# EAGLE design TestBench SD Shield (EAGLE 6.1)
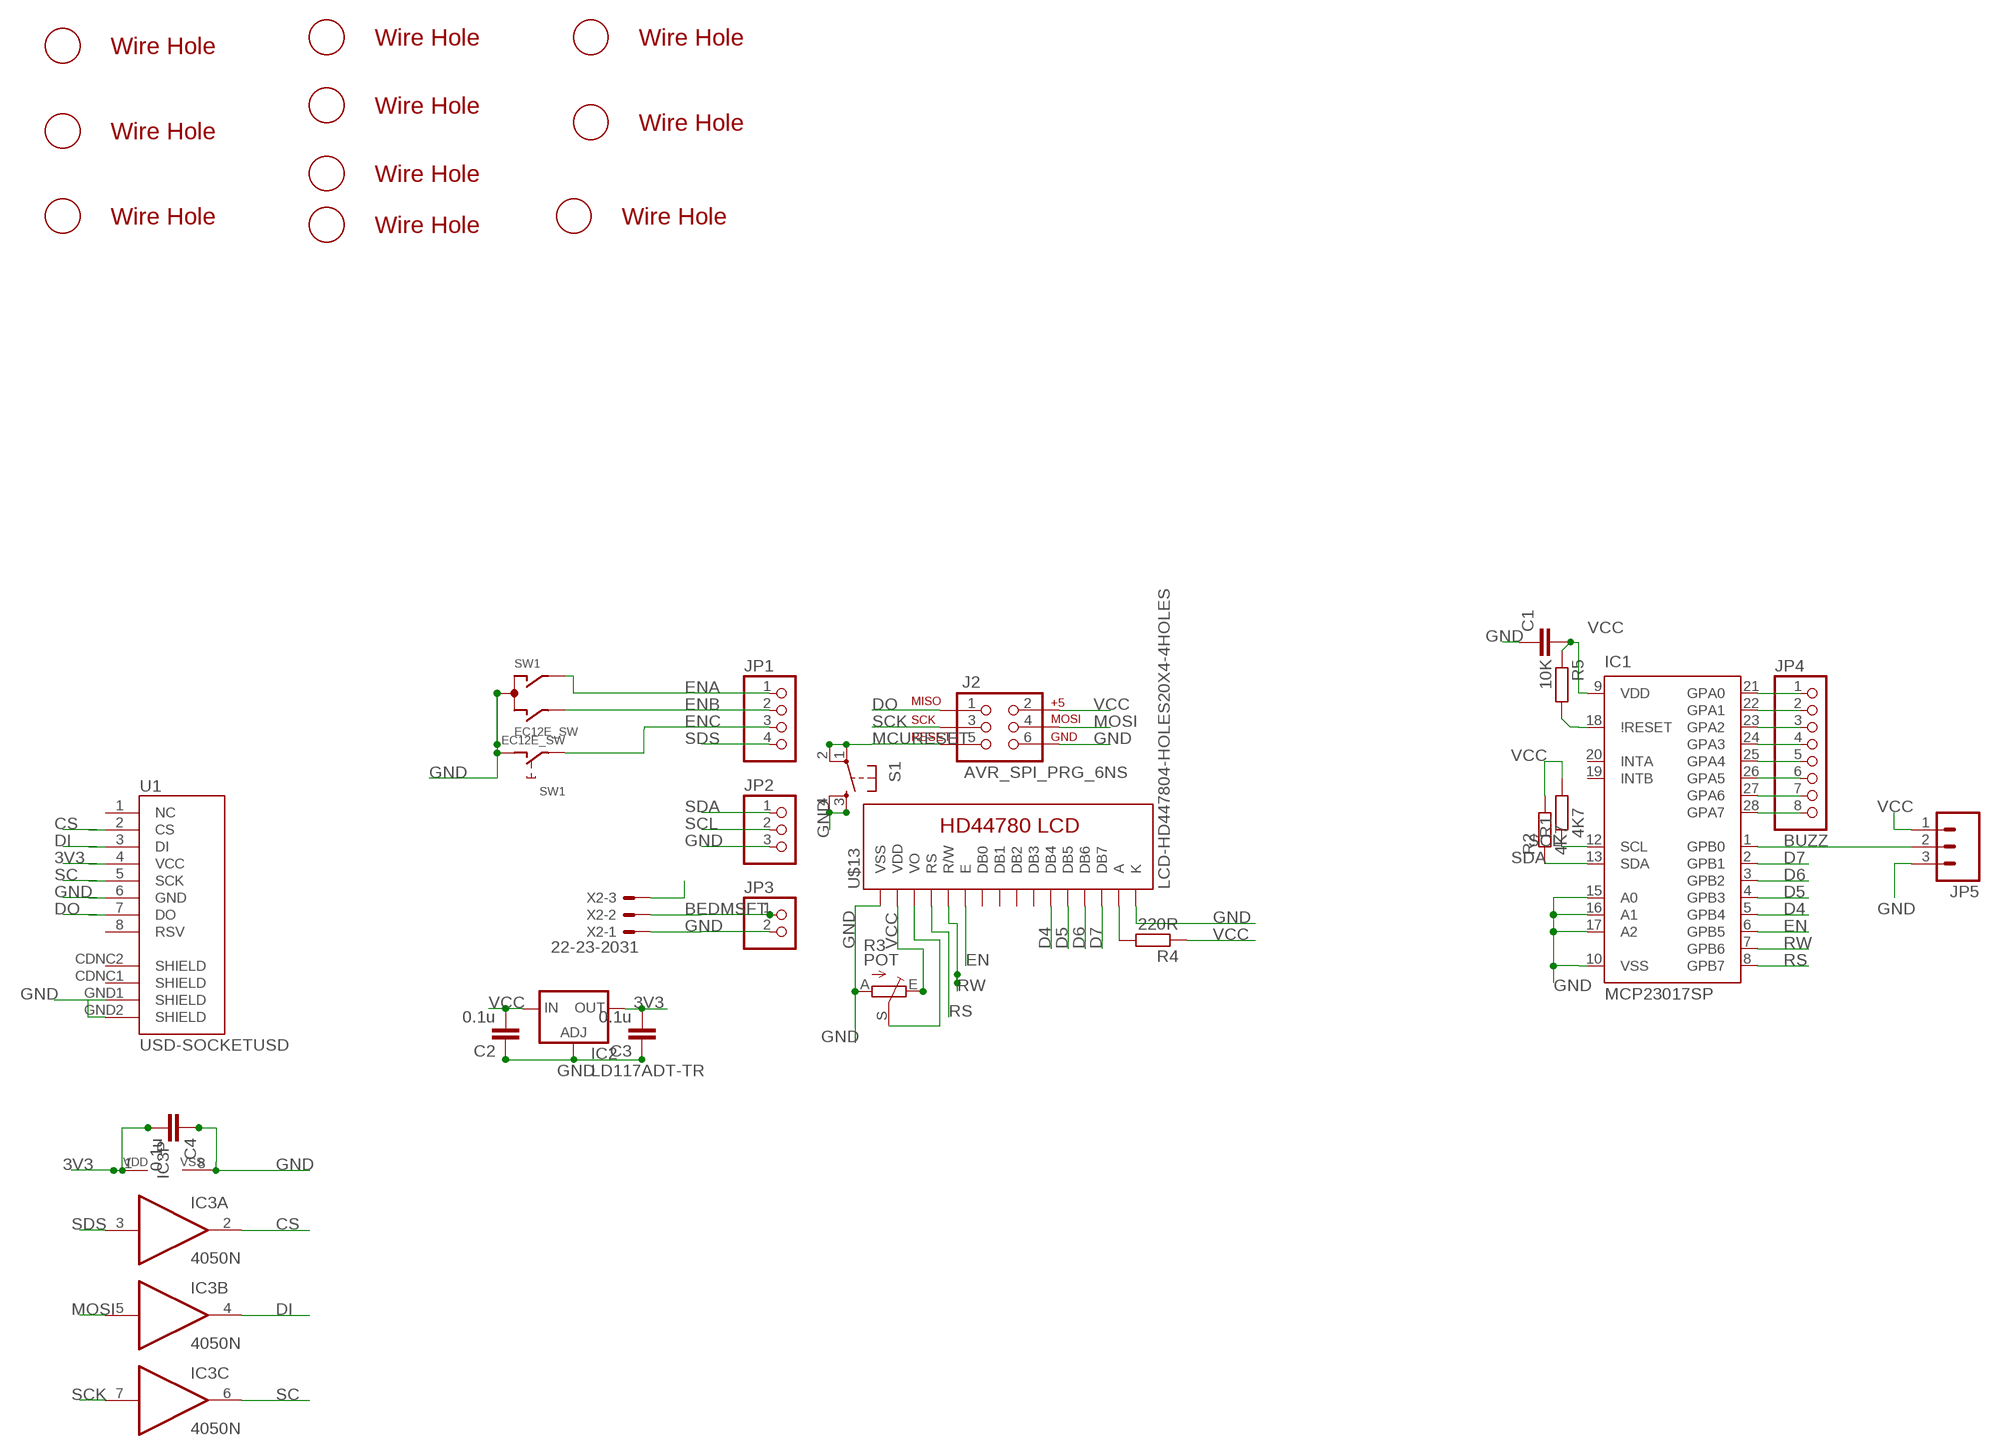
[diagram p0: schematic, sheet 1]

## Parts
C1  CAPKIT  [CAP-PTH-SMALL-KIT]
C2  0.1u  CAPKIT  [CAP-PTH-SMALL-KIT]
C3  0.1u  CAPKIT  [CAP-PTH-SMALL-KIT]
C4  0.1u  CAPKIT  [CAP-PTH-SMALL-KIT]
IC1  MCP23017SP  [DIL28-3]
IC2  LD117ADT-TR  [DPACK]
IC3  4050N  [DIL16]
J2  AVR_SPI_PRG_6NS  [2X3-NS]
JP1  PINHD-1X4  [1X04]
JP2  PINHD-1X3  [1X03]
JP3  PINHD-1X2  [1X02]
JP4  PINHD-1X8  [1X08]
JP5  M03LONGPADS  [1X03_LONGPADS]
R1  4K7  R-EU_0204/7  [0204/7]
R2  4K7  R-EU_0204/7  [0204/7]
R3  POT  TRIM_EU-CA9V  [CA9V]
R4  220R  R-EU_0204/7  [0204/7]
R5  10K  R-EU_0204/7  [0204/7]
S1  TAC_SWITCHPTH  [TACTILE-PTH]
SW1  EC12E_SW  [ALPS_EC12E_SW]
U1  USD-SOCKETUSD  [USD-SOCKET-PP]
U$1  3MMHOLE  [3MMHOLE]
U$3  3MMHOLE  [3MMHOLE]
U$5  3MMHOLE  [3MMHOLE]
U$6  3MMHOLE  [3MMHOLE]
U$7  3MMHOLE  [3MMHOLE]
U$8  3MMHOLE  [3MMHOLE]
U$9  3MMHOLE  [3MMHOLE]
U$10  3MMHOLE  [3MMHOLE]
U$11  3MMHOLE  [3MMHOLE]
U$12  3MMHOLE  [3MMHOLE]
U$13  LCD-HD447804-HOLES20X4-4HOLES  [LCD-20X4-4HOLES]
X2  22-23-2031  [22-23-2031]

## Nets
3V3: C3.2 C4.2 IC2.4(OUT) IC3.1(P:VDD) U1.4(VCC)
BEDMSFT: JP3.1 X2.2
BUZZ: IC1.1(GPB0) JP5.2
CONTRAST: R3.S U$13.P$3(VO)
CS: IC3.2(A:O) U1.2(CS)
D4: IC1.5(GPB4) U$13.P$11(DB4)
D5: IC1.4(GPB3) U$13.P$12(DB5)
D6: IC1.3(GPB2) U$13.P$13(DB6)
D7: IC1.2(GPB1) U$13.P$14(DB7)
DI: IC3.4(B:O) U1.3(DI)
DO: J2.1 U1.7(DO)
EN: IC1.6(GPB5) U$13.P$6(E)
ENA: JP1.1 SW1.A
ENB: JP1.2 SW1.B
ENC: JP1.3 SW1.E
GND: C1.1 C2.1 C3.1 C4.1 IC1.10(VSS) IC1.15(A0) IC1.16(A1) IC1.17(A2) IC2.1(ADJ) IC3.8(P:VSS) J2.6 JP2.3 JP3.2 JP5.3 R3.A S1.3 S1.4 SW1.C SW1.D U1.6(GND) U1.GND1(SHIELD) U1.GND2(SHIELD) U$13.P$1(VSS) U$13.P$16(K) X2.1
MCURESET: J2.5 S1.1 S1.2
MOSI: IC3.5(B:I) J2.4
N$1: IC1.28(GPA7) JP4.8
N$2: IC1.27(GPA6) JP4.7
N$3: IC1.26(GPA5) JP4.6
N$4: IC1.25(GPA4) JP4.5
N$5: IC1.24(GPA3) JP4.4
N$6: IC1.23(GPA2) JP4.3
N$7: IC1.22(GPA1) JP4.2
N$8: IC1.21(GPA0) JP4.1
N$9: X2.3
N$11: R4.2 U$13.P$15(A)
N$12: IC1.18(\!RESET) R5.2
RS: IC1.8(GPB7) U$13.P$4(RS)
RW: IC1.7(GPB6) U$13.P$5(R/W)
SC: IC3.6(C:O) U1.5(SCK)
SCK: IC3.7(C:I) J2.3
SCL: IC1.12(SCL) JP2.2 R1.1
SDA: IC1.13(SDA) JP2.1 R2.1
SDS: IC3.3(A:I) JP1.4
VCC: C1.2 C2.2 IC1.9(VDD) IC2.3(IN) J2.2 JP5.1 R1.2 R2.2 R3.E R4.1 R5.1 U$13.P$2(VDD)
Unconnected: IC1.19(INTB) IC1.20(INTA) IC3.9(D:I) IC3.10(D:O) IC3.11(E:I) IC3.12(E:O) IC3.14(F:I) IC3.15(F:O) SW1.GND1(G) SW1.GND2(G) U1.1(NC) U1.8(RSV) U1.CDNC1(SHIELD) U1.CDNC2(SHIELD) U$13.P$7(DB0) U$13.P$8(DB1) U$13.P$9(DB2) U$13.P$10(DB3)

## Library data of the parts
C1-C4 = SparkFun-Passives:CAP: Capacitor Standard 0603 ceramic capacitor, and 0.1" leaded capacitor.
IC1 = microchip-update-2:MCP23017: http://ww1.microchip.com/downloads/en/DeviceDoc/21952a.pdf Source: http://ww1.microchip.com/downloads/en/DeviceDoc/21952a.pdf
IC2 = v-reg:LD117A?*: Low drop fixed and adjustable positive voltage regulators 1 A Source: http://www.st.com/stonline/products/literature/ds/7194/ld1117axx.pdf
IC3 = 40xx:4050: Hex non-inverting BUFFER
J2 = SparkFun-Connectors:AVR_SPI_PRG_6: AVR ISP 6 Pin This is the reduced ISP connector for AVR programming. Common on Arduino. This footprint will take up less PCB space and can be used with a 10-pin to 6-pin adapter such as SKU: BOB-08508
JP1 = pinhead:PINHD-1X4: PIN HEADER
JP2 = pinhead:PINHD-1X3: PIN HEADER
JP3 = pinhead:PINHD-1X2: PIN HEADER
JP4 = pinhead:PINHD-1X8: PIN HEADER
JP5 = SparkFun-Connectors:M03: Header 3 Standard 3-pin 0.1" header. Use with straight break away headers (SKU : PRT-00116), right angle break away headers (PRT-00553), swiss pins (PRT-00743), machine pins (PRT-00117), and female headers (PRT-00115). Molex polarized connector foot print use with SKU : PRT-08232 with associated crimp pins and housings.
R1 R2 R4 R5 = rcl:R-EU_: RESISTOR, European symbol
R3 = pot:TRIM_EU-: POTENTIOMETER
S1 = SparkFun-Electromechanical:TAC_SWITCH: Momentary Switch Button commonly used for reset or general input. Spark Fun Electronics SKU : COM-00097
SW1 = switch-alps:EC12E_SW: ALPS rotary Encoder EC12E series with switch; MPN: EC12E2424407; OC_FARNELL: 1520813; OC_NEWARK: 74M1068
U1 = SparkFun-Connectors_PETERMICROSDEBAY:USD-SOCKET: microSD Socket Push-push type uSD socket. Schematic element and footprint production proven. Spark Fun Electronics SKU : PRT-00127. tDoc lines correctly indicate media card edge positions when inserting (unlocked, locked, depressed).
U$1 U$3 U$5-U$12 = reprap:3MMHOLE
U$13 = HD44780LCD:LCD-HD44780
X2 = con-molex:22-23-2031: .100" (2.54mm) Center Header - 3 Pin; MF: MOLEX; MPN: 22-23-2031; OC_FARNELL: 1462950; OC_NEWARK: 30C0862

## Board
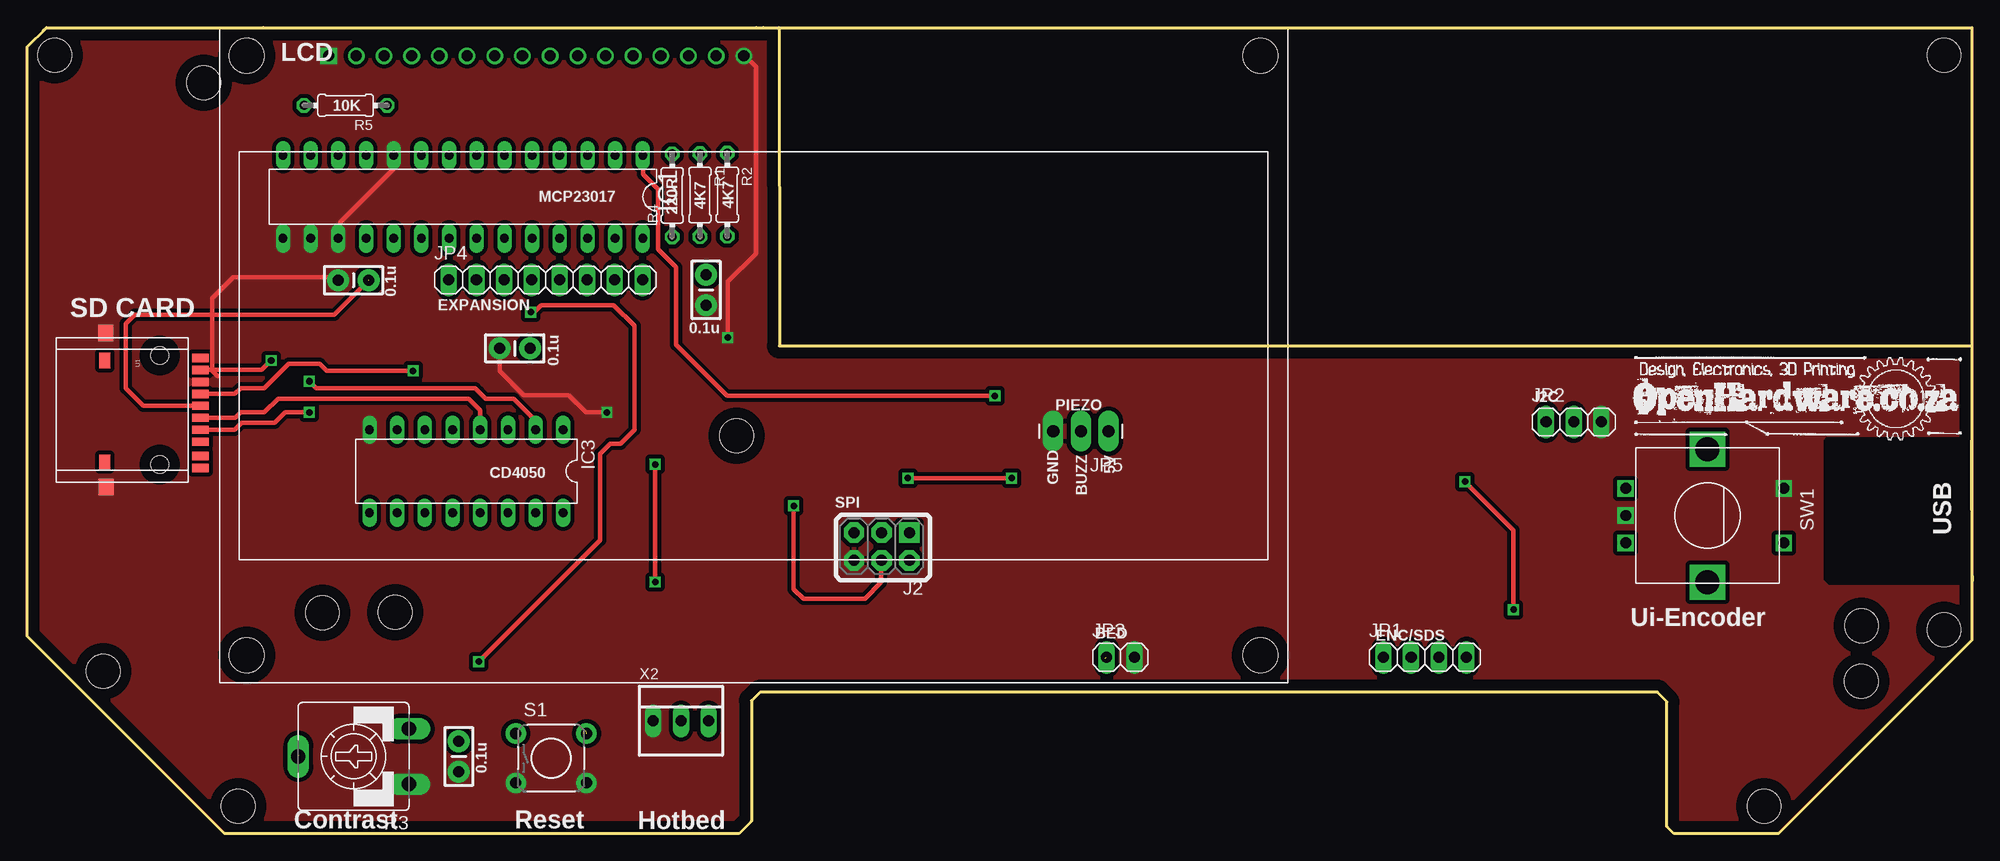
[diagram p1: board, top side]
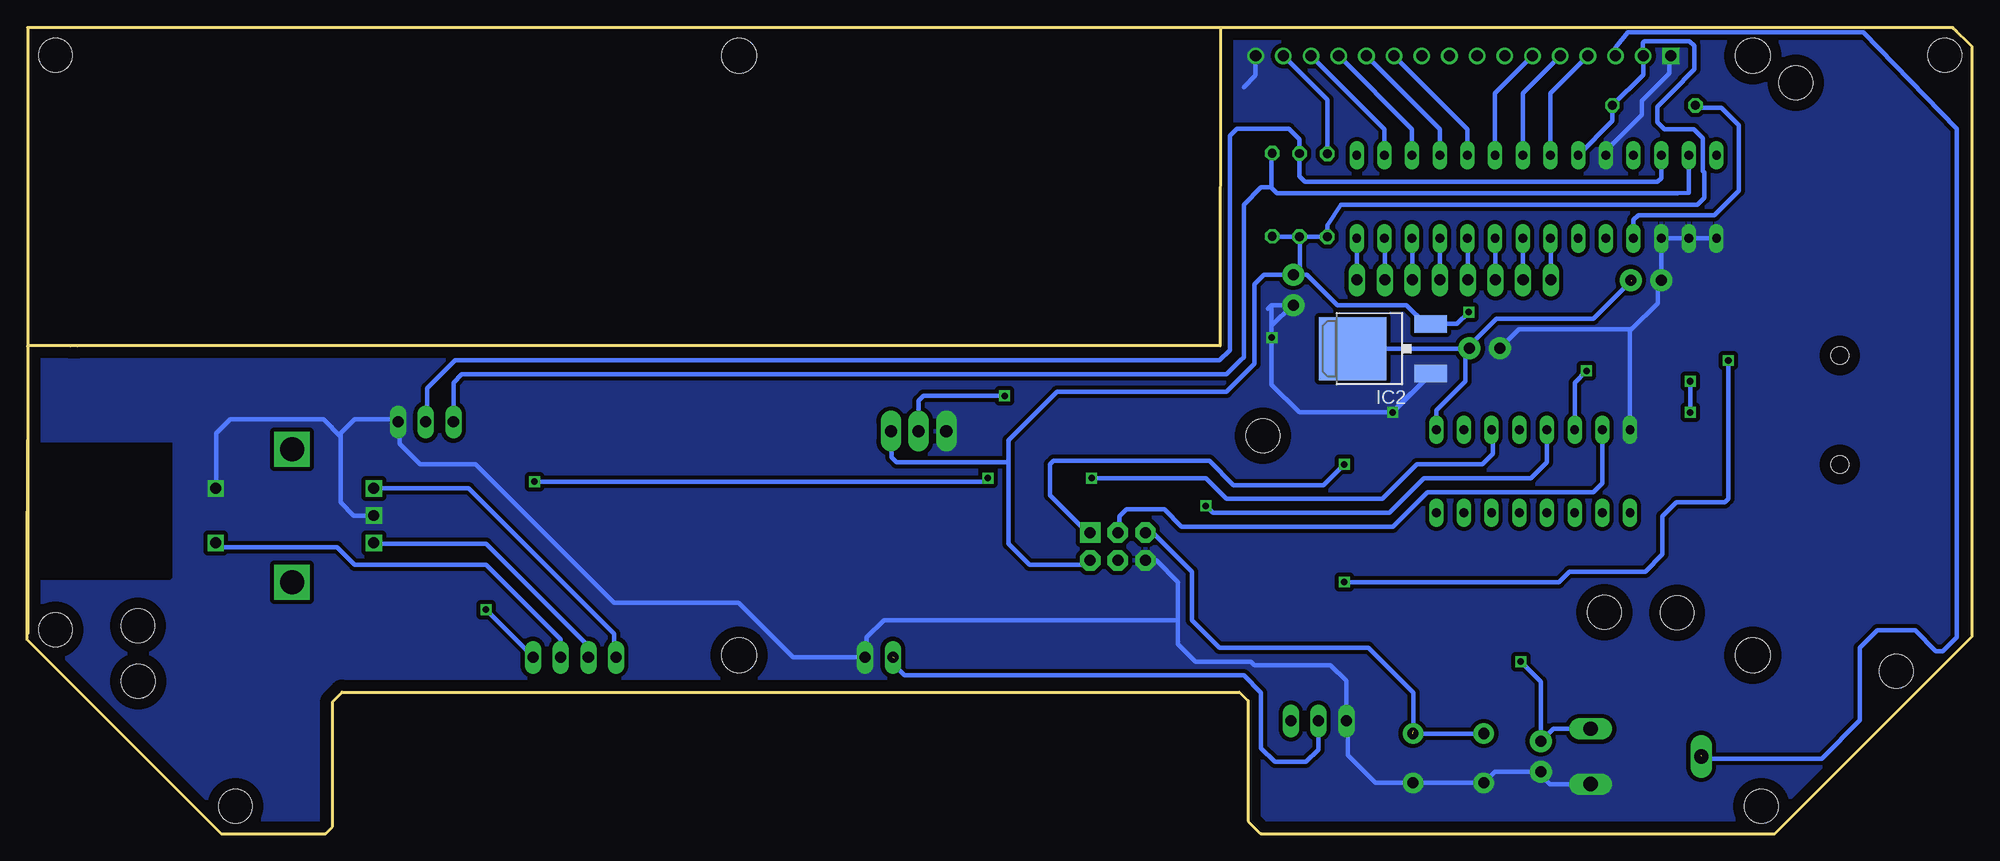
[diagram p2: board, bottom side, seen from below]

Size 178.47 x 73.97 mm. Coordinates in mm from the lower left corner, seen from the top.
Outline: 178.43,36.1 178.47,23.14 178.44,23.67 178.47,23.05 178.47,17.75
Outline: 68.98,73.97 69.02,44.74 174.5,44.74
Outline: 1.46,73.63 1.78,73.95
Outline: 1.78,73.95 21.65,73.95 66.9,73.95 67.54,73.95 178.44,73.95 178.44,18.32
Outline: 178.43,17.75 160.69,0 151.1,0 150.46,0.63 150.46,12.1 149.57,12.99 67.25,12.99 66.45,12.19 66.45,1.14 65.31,0 18.1,0 0,18.1 0,72.2 1.78,73.95
Outline: 178.4,35.97 178.43,36
Outline: 173.84,44.74 178.43,44.74 178.43,44.71
Copper layers (1*16): Top 0.035mm / dielectric 1.5mm / Bottom 0.035mm
Design rules: minimum track width 10mil, minimum drill 20mil, track to track 15mil, track to pad 15mil, pad to pad 15mil, via to via 15mil, smd to smd 15mil, copper to edge 40mil, drill to drill 8mil, minimum pad ring 10mil, minimum via ring 8mil, stop-mask expansion 1mil, vias tented up to drill 0mil, thermal gap 0mil

### Footprints (pad centres in the part's own frame; a part is rotated, then mirrored left to right if it is on the bottom)
CAP-PTH-SMALL-KIT = drill 1.016 pad 2.032: 1 -1.397,0; 2 1.397,0
DIL28-3 = drill 0.813 long: 1 -16.51,-3.81; 2 -13.97,-3.81; 3 -11.43,-3.81; 4 -8.89,-3.81; 5 -6.35,-3.81; 6 -3.81,-3.81; 7 -1.27,-3.81; 8 1.27,-3.81; 9 3.81,-3.81; 10 6.35,-3.81; 11 8.89,-3.81; 12 11.43,-3.81; 13 13.97,-3.81; 14 16.51,-3.81; 15 16.51,3.81; 16 13.97,3.81; 17 11.43,3.81; 18 8.89,3.81; 19 6.35,3.81; 20 3.81,3.81; 21 1.27,3.81; 22 -1.27,3.81; 23 -3.81,3.81; 24 -6.35,3.81; 25 -8.89,3.81; 26 -11.43,3.81; 27 -13.97,3.81; 28 -16.51,3.81
DPACK = smd 1.6 x 3: 1 -2.28,-4.8; 3 2.28,-4.8 | smd 5.8 x 6.2: 4 0,2.38
DIL16 = drill 0.813 long: 1 -8.89,-3.81; 2 -6.35,-3.81; 3 -3.81,-3.81; 4 -1.27,-3.81; 5 1.27,-3.81; 6 3.81,-3.81; 7 6.35,-3.81; 8 8.89,-3.81; 9 8.89,3.81; 10 6.35,3.81; 11 3.81,3.81; 12 1.27,3.81; 13 -1.27,3.81; 14 -3.81,3.81; 15 -6.35,3.81; 16 -8.89,3.81
2X3-NS = drill 1.016 pad 1.88 square: 1 -2.54,-1.27 | drill 1.016 pad 1.88 octagon: 2 -2.54,1.27; 3 0,-1.27; 4 0,1.27; 5 2.54,-1.27; 6 2.54,1.27
1X04 = drill 1.016 long: 1 -3.81,0; 2 -1.27,0; 3 1.27,0; 4 3.81,0
1X03 = drill 1.016 long: 1 -2.54,0; 2 0,0; 3 2.54,0
1X02 = drill 1.016 long: 1 -1.27,0; 2 1.27,0
1X08 = drill 1.016 long: 1 -8.89,0; 2 -6.35,0; 3 -3.81,0; 4 -1.27,0; 5 1.27,0; 6 3.81,0; 7 6.35,0; 8 8.89,0
1X03_LONGPADS = drill 1.118 pad 1.88 long: 1 0,0; 2 2.54,0; 3 5.08,0
0204/7 = drill 0.813 octagon: 1 -3.81,0; 2 3.81,0
CA9V = drill 1.321 long: A -2.54,-5.08; E 2.54,-5.08; S 0,5.08
TACTILE-PTH = drill 1.016 pad 1.88: 1 -3.251,2.261; 2 3.251,2.261; 3 -3.251,-2.261; 4 3.251,-2.261
ALPS_EC12E_SW = drill 1 square: A -2.5,-7.5; B 2.5,-7.5; C 0,-7.5; D -2.5,7; E 2.5,7 | drill 2.2 square: GND1 -6.1,0; GND2 6.1,0
USD-SOCKET-PP = smd 0.75 x 1.5: 1 2.925,1.125; 2 1.825,1.125; 3 0.725,1.125; 4 -0.375,1.125; 5 -1.475,1.125; 6 -2.575,1.125; 7 -3.675,1.125; 8 -4.775,1.125; CD1 5.325,1.125; CD2 4.225,1.125 | smd 1.4 x 1: CDNC1 -4.55,-7.65 | smd 1.3 x 1: CDNC2 4.775,-7.65 | smd 1.5 x 1.35: GND1 -7.075,-7.55; GND2 7.075,-7.5 | hole 1.6: -5,-2.6; 5,-2.6
3MMHOLE = hole 3.1: 0,0
LCD-20X4-4HOLES = drill 1.016 square: P$1 10,57.5 | drill 1.016: P$2 12.54,57.5; P$3 15.08,57.5; P$4 17.62,57.5; P$5 20.16,57.5; P$6 22.7,57.5; P$7 25.24,57.5; P$8 27.78,57.5; P$9 30.32,57.5; P$10 32.86,57.5; P$11 35.4,57.5; P$12 37.94,57.5; P$13 40.48,57.5; P$14 43.02,57.5; P$15 45.56,57.5; P$16 48.1,57.5 | hole 3.2: 2.5,2.5; 2.5,57.5; 95.5,57.5; 95.5,2.5
22-23-2031 = drill 1 long: 1 -2.54,0; 2 0,0; 3 2.54,0

### Placement (x,y rotation side)
C1  62.29,49.88 90 top
C2  39.59,7.08 90 top
C3  44.74,44.51 0 top
C4  29.94,50.77 0 top
IC1  39.97,58.42 180 top
IC2  54.48,44.48 90 bottom
IC3  40.29,33.24 180 top
J2  78.4,26.33 180 top
JP1  128.25,16.17 0 top
JP2  141.9,37.76 0 top
JP3  100.31,16.17 0 top
JP4  47.56,50.8 0 top
JP5  99.22,36.91 180 top
R1  61.72,58.58 270 top
R2  64.23,58.61 270 top
R3  29.94,7.08 90 top
R4  59.18,58.55 90 top
R5  29.21,66.8 180 top
S1  48.07,6.92 0 top
SW1  154.18,29.18 270 top
U1  14.75,38.86 270 top
U$1  16.17,68.88 0 top
U$2  3MMHOLE  [3MMHOLE]  2.52,71.42 0 top
U$3  65.07,36.49 0 top
U$4  3MMHOLE  [3MMHOLE]  19.35,2.52 0 top
U$5  159.37,2.52 0 top
U$6  175.88,18.71 0 top
U$7  6.97,14.9 0 top
U$8  175.88,71.42 0 top
U$9  33.75,20.32 0 top
U$10  27.08,20.26 0 top
U$11  168.27,13.97 0 top
U$12  168.31,19.08 0 top
U$13  17.65,13.84 0 top
X2  59.98,10.35 0 top

### Tracks (layer width: path | path; a pad name or v marks a point on that pad's centre or on a via)
3V3  (1 unrouted)
  Top 0.406: U1.4 10.65,39.24 9.04,40.84 9.04,46.75 9.87,47.58 28.15,47.58 C4.2
  Bottom 0.406: C3.2 46.13,44.74 43.66,47.21 34.77,47.21 31.27,50.7 | IC2.4 46.16,44.48 C3.2 | IC3.1 49.18,38.83 46.51,41.5 46.51,44.13 C3.2
BEDMSFT  (1 unrouted)
  Bottom 0.406: X2.2 59.98,7.72 61.12,6.57 63.98,6.57 65.25,7.84 65.25,12.92 66.83,14.51 97.95,14.51 98.9,15.46 98.9,15.78 99.22,16.1 98.9,16.1
BUZZ  (via drill 0.6)
  Top 0.406: v88.78,40.15 64.22,40.15 59.53,44.84 59.53,51.97 57.88,53.62 57.88,59.1 56.49,60.49 56.49,62.22 IC1.1
  Bottom 0.406: JP5.2 96.68,39.72 96.25,40.15 v88.78,40.15
CONTRAST  (1 unrouted)
  Bottom 0.406: U$13.P$3 32.73,72.11 31.59,73.5 10,73.5 1.43,64.67 1.43,18 2.7,16.73 3.33,16.73 5.24,18.64 8.73,18.64 10.32,17.05 10.32,10.38 13.81,6.89 24.92,6.89 | 24.92,6.89 24.92,7.21 24.92,6.89
CS  (via drill 0.6)
  Top 0.406: IC3.2 46.64,37.88 44.61,39.91 42.07,39.91 41.43,40.54 41.12,40.86 26.51,40.86 v25.88,41.5 | v25.88,38.64 23.65,38.64 22.7,37.69 19.69,37.69 19.04,37.04 U1.2
  Bottom 0.406: v25.88,41.5 v25.88,38.64
D4
  Bottom 0.406: IC1.5 46.32,64.61 U$13.P$11
D5
  Bottom 0.406: IC1.4 48.86,64.61 U$13.P$12
D6
  Bottom 0.406: IC1.3 51.4,64.61 U$13.P$13
D7
  Bottom 0.406: IC1.2 53.94,64.61 U$13.P$14
DI
  Top 0.406: IC3.4 41.56,38.83 40.48,39.91 23.02,39.91 21.75,38.64 19.58,38.64 19.07,38.14 U1.3
DO  (via drill 0.6)
  Top 0.406: v57.63,33.88 v57.63,23.08 | 22.04,43.06 v22.38,43.4 21.52,42.54 U1.7
  Bottom 0.406: J2.1 81.2,27.6 84.61,31.02 84.61,33.88 84.3,34.19 70.01,34.19 67.79,31.97 59.53,31.97 v57.63,33.88 | v57.63,23.08 37.94,23.08 36.99,24.03 30,24.03 28.42,25.62 28.42,29.11 27.15,30.38 26.51,30.38 22.7,30.38 22.38,30.7 v22.38,43.4
EN
  Bottom 0.406: IC1.6 43.78,67.91 U$13.P$6
ENA
  Bottom 0.406: SW1.A 137.98,31.68 124.62,18.32 124.62,16.35 JP1.1
ENB
  Bottom 0.406: JP1.2 126.98,17.19 136.37,26.57 146.57,26.57 SW1.B
ENC
  Bottom 0.406: JP1.3 129.52,17.82 136.37,24.67 148.43,24.67 150.02,26.26 160.76,26.26 SW1.E
GND  (via drill 0.6)
  Top 0.406: 17.48,41.96 16.99,42.45 16.99,49.12 18.89,51.02 28.29,51.02 C4.1 | v53.18,38.64 51.28,38.64 49.69,40.23 45.56,40.23 43.34,42.45 C3.1 | IC1.10 33.62,60.99 28.73,56.1 28.73,54.8 IC1.17 | v64.26,45.5 64.26,50.61 66.87,53.21 66.87,70.33 65.82,71.37
  Bottom 0.406: U$13.P$16 65.75,69.57 66.83,68.48 | IC1.10 33.62,62.64 30.32,65.94 30.32,67.21 27.78,69.75 27.78,71.21 U$13.P$1 | IC1.15 IC1.16 IC1.17 C4.1 28.86,50.45 28.86,48.67 31.27,46.26 | SW1.C 148.49,29.18 149.7,30.38 | 149.7,30.38 149.7,36.73 148.43,38 144.94,38 144.62,37.69 144.3,37.37 144.3,37.69 144.62,38 | 149.7,30.38 149.7,36.42 151.29,38 159.86,38 161.13,36.73 161.13,31.72 SW1.D | JP3.2 108.18,16.17 113.19,21.18 124.62,21.18 137.32,33.88 142.4,33.88 144.3,35.78 144.3,37.62 JP2.3 | R3.A 38.77,4.54 39.85,5.62 | C2.1 43.8,5.68 S1.3 S1.4 54.76,4.66 57.31,7.21 57.31,10.22 X2.1 57.44,14 58.9,15.46 65.88,15.46 66.2,15.78 71.28,15.78 72.87,17.37 72.87,19.59 | 64.29,48.48 C1.1 62.39,48.48 64.29,46.58 64.29,41.18 61.75,38.64 53.24,38.64 IC2.1 49.68,42.14 v53.18,38.64 | 64.29,48.48 64.61,48.16 | J2.6 74.85,25.06 72.87,23.08 72.87,19.59 | 72.87,19.59 99.85,19.59 101.44,18 101.44,16.41 | IC3.8 31.4,46.13 31.27,46.26 | 31.27,46.26 41.59,46.26 C3.1 | 64.29,48.48 64.29,45.53 v64.26,45.5
  pour Bottom: 0.16,72.29 0.48,72.29 1.75,73.56 68.1,73.56 68.74,72.93 68.74,44.99 69.37,44.35 174.78,44.35 175.1,44.67 175.1,64.99 174.78,65.31 171.29,65.31 170.97,65.63 170.97,73.25 171.61,73.88 178.28,71.98 178.28,36.42 177.96,36.1 164.94,36.1 164.94,23.4 165.26,23.08 177.96,23.08 178.28,22.76 178.28,18 160.81,0.54 151.29,0.54 150.97,0.86 150.97,11.97 149.38,13.56 67.47,13.56 66.2,12.29 66.2,1.17 65.25,0.22 17.94,0.22 -0.16,18.32 -0.16,71.98
  pour Top: 0.42,65.31 0.55,71.52 2.67,73.3 67.85,73.3 68.64,72.51 68.64,44.31 69.04,43.91 174.7,43.91 175.1,43.95 175.36,43.88 178.1,43.91 178.33,43.78 178.5,40.81 178.47,37.34 178.07,36.98 177.67,36.58 164.99,36.58 164.6,36.19 164.6,23.18 165.19,22.58 177.41,22.58 178.14,21.86 178.14,18.09 160.5,0.46 151.13,0.46 150.93,0.66 150.93,12.28 150,13.2 66.86,13.2 65.93,12.28 65.93,1.71 64.61,0.39 18.39,0.39 0.42,18.36 0.42,63.66 0.42,64.78 0.42,65.18
MCURESET  (1 unrouted)
  Bottom 0.406: S1.1 S1.2 | J2.5 75.16,27.6 71.6,24.03 71.6,19.59 69.06,17.05 55.4,17.05 51.28,12.92 51.28,9.43
MOSI  (via drill 0.6)
  Top 0.406: v70.33,30.07 70.33,26.89 70.33,25.65 70.33,22.42 71.22,21.52 76.65,21.52 76.87,21.56 78.33,23.08 78.33,24.86 J2.4
  Bottom 0.406: IC3.5 39.02,34.07 40.48,32.61 50.32,32.61 53.5,29.43 69.69,29.43 v70.33,30.07
N$1
  Bottom 0.406: JP4.8 56.45,54.58 IC1.28
N$2
  Bottom 0.406: JP4.7 53.91,54.58 IC1.27
N$3
  Bottom 0.406: JP4.6 51.37,54.58 IC1.26
N$4
  Bottom 0.406: JP4.5 48.83,54.58 IC1.25
N$5
  Bottom 0.406: JP4.4 46.29,54.58 IC1.24
N$6
  Bottom 0.406: JP4.3 43.75,54.58 IC1.23
N$7
  Bottom 0.406: JP4.2 41.21,54.58 IC1.22
N$8
  Bottom 0.406: JP4.1 38.67,54.58 IC1.21
N$11
  Bottom 0.406: R4.2 59.18,67.31 U$13.P$15
N$12
  Bottom 0.406: IC1.18 31.08,56.29 30.64,56.74 23.65,56.74 21.43,58.96 21.43,64.99 23.02,66.58 25.18,66.58 R5.2
RS
  Bottom 0.406: IC1.8 38.7,67.91 U$13.P$4
RW
  Bottom 0.406: IC1.7 41.24,67.91 U$13.P$5
SC  (via drill 0.6)
  Top 0.406: v35.4,42.45 27.46,42.45 26.83,43.08 23.97,43.08 21.75,40.86 19.57,40.86 19.04,40.34 U1.5
  Bottom 0.406: IC3.6 36.48,41.37 v35.4,42.45
SCK
  Bottom 0.406: IC3.7 33.94,32.16 34.77,31.34 50.01,31.34 53.18,28.16 72.55,28.16 74.14,29.75 77.63,29.75 78.26,29.11 78.26,27.74 J2.3
SCL
  Bottom 0.406: IC1.12 28.54,60.13 28.89,59.78 61.21,59.78 61.72,60.29 | 61.72,60.29 R1.1 | 61.72,60.29 61.72,63.69 62.71,64.67 67.47,64.67 68.1,64.04 68.1,44.35 69.06,43.4 139.22,43.4 141.76,40.86 141.76,37.9 JP2.2
SDA
  Bottom 0.406: IC1.13 26,58.8 27.02,58.74 63.79,58.74 64.29,59.25 | 64.29,59.25 64.29,62.36 R2.1 | JP2.1 139.36,41.36 138.59,42.13 68.42,42.13 67.15,43.4 66.83,43.72 66.83,57.69 65.25,59.28 64.33,59.28 64.29,59.25
SDS  (via drill 0.6)
  Top 0.406: v136.37,20.54 136.37,27.84 v131.92,32.29 | v90.33,32.61 v80.8,32.61
  Bottom 0.406: JP1.4 132.06,16.24 v136.37,20.54 | v131.92,32.29 90.65,32.29 v90.33,32.61 | v80.8,32.61 70.33,32.61 68.42,30.7 54.13,30.7 50.96,33.88 44.93,33.88 43.97,34.83 43.97,36.92 IC3.3
VCC  (via drill 0.6)
  Top 0.406: v46.2,47.85 46.51,47.85 47.15,48.48 53.82,48.48 55.72,46.58 55.72,37.05 54.45,35.78 53.5,35.78 52.55,34.83 52.55,26.89 v41.43,15.78
  Bottom 0.406: 80.94,24.75 J2.2 81.34,24.67 86.52,24.67 88.42,26.57 88.42,36.1 | IC1.9 33.02,65.37 R5.1 30.19,69.63 U$13.P$2 30.19,71.37 30.16,71.41 30.23,71.47 30.32,71.47 30.23,71.56 30.23,72.55 30.07,72.71 25.94,72.71 25.49,72.26 25.49,70.1 26.51,69.09 26.51,69.06 28.89,66.67 28.89,65.25 28.26,64.61 25.53,64.61 24.7,63.79 24.7,60.77 24.61,60.67 24.61,58.32 25.24,57.69 36.04,57.69 57.94,57.69 59.18,55.82 R4.1 61.69,54.74 | 61.69,54.74 R1.2 64.2,54.77 R2.2 | 61.69,54.74 61.69,51.88 C1.2 | R3.E 38.45,9.62 C2.2 39.59,13.94 v41.43,15.78 41.75,16.1 | C1.2 61.06,51.28 59.21,49.43 58.26,48.48 51.91,48.48 50.19,46.76 IC2.3 47.28,46.76 v46.2,47.85 | C1.2 64.99,51.28 65.88,50.39 65.88,43.08 68.42,40.54 83.98,40.54 88.42,36.1 | 88.42,36.1 88.42,34.24 88.59,34.07 98.69,34.07 99.15,34.53 99.15,36.85 JP5.1

### Text on the board
tPlace: LCD | 10K | MCP23017 | 4K7 | 4K7 | 220R | 0.1u | SD CARD | EXPANSION | 0.1u | 0.1u | I2C | PIEZO | CD4050 | 5V | GND | SPI | BUZZ | USB | Ui-Encoder | BED | ENC/SDS | 0.1u | Contrast | Reset | Hotbed